# Altium schematic sheet Sheet1.SchDoc
size A4; SheetNumber: 1; SheetTotal: 1
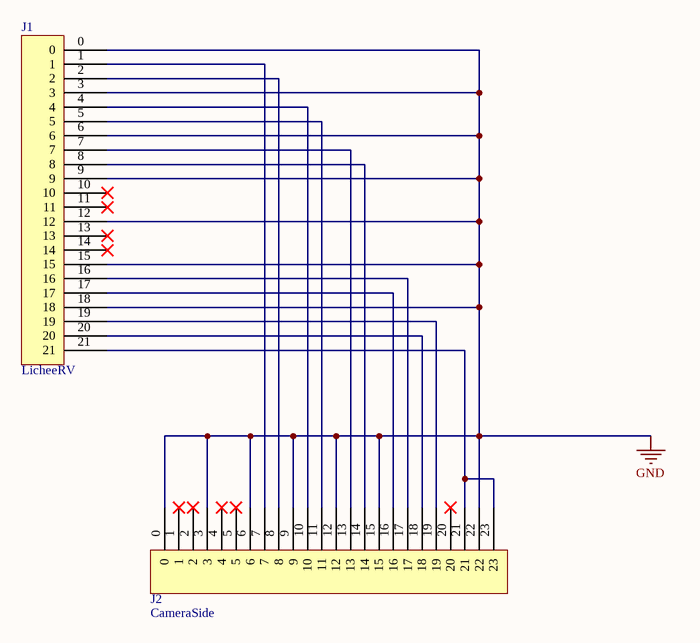
[diagram p0: Sheet1.SchDoc]

## Parts
J1  LicheeRV  [Nano]
J2  CameraSide  [Camera]

## Nets
GND: J1.0 J1.3 J1.6 J1.9 J1.12 J1.15 J1.18 J2.0 J2.3 J2.6 J2.9 J2.12 J2.15 J2.22
NetJ1_1: J1.1 J2.7
NetJ1_2: J1.2 J2.8
NetJ1_4: J1.4 J2.10
NetJ1_5: J1.5 J2.11
NetJ1_7: J1.7 J2.13
NetJ1_8: J1.8 J2.14
NetJ1_16: J1.16 J2.17
NetJ1_17: J1.17 J2.16
NetJ1_19: J1.19 J2.19
NetJ1_20: J1.20 J2.18
NetJ1_21: J1.21 J2.21 J2.23

Not connected (* = marked no-connect by the designer): J1 10* 11* 13* 14*; J2 1* 2* 4* 5* 20*

## Library data of the parts
J2 = CameraSide_1